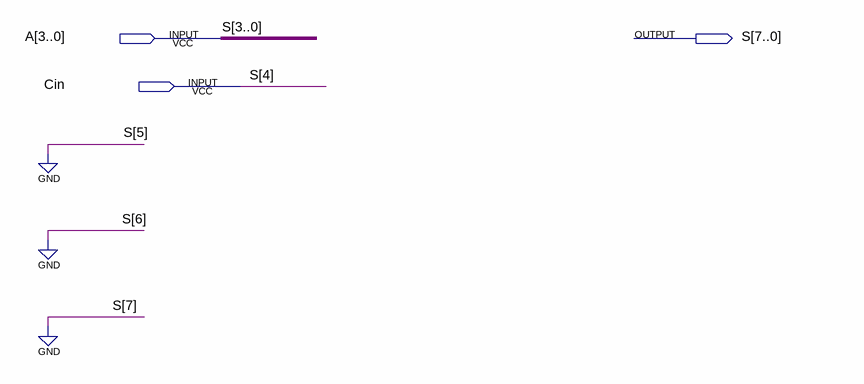
[diagram p0: schematic sheet]
// Quartus schematic incrementador.bdf as structural Verilog: 0 symbols, 3 pins
module incrementador (
  input  [3:0] A,
  input  Cin,
  output [7:0] S
);


  assign S = {3'b000, Cin, A};
endmodule
